# EasyEDA schematic doan20192.json
TITLE: Do an ver 1; REV: 1.0; Date: 2020-02-19; Sheet: 1/1; Drawn By: dienvx1997bn; Company: DCE HUST
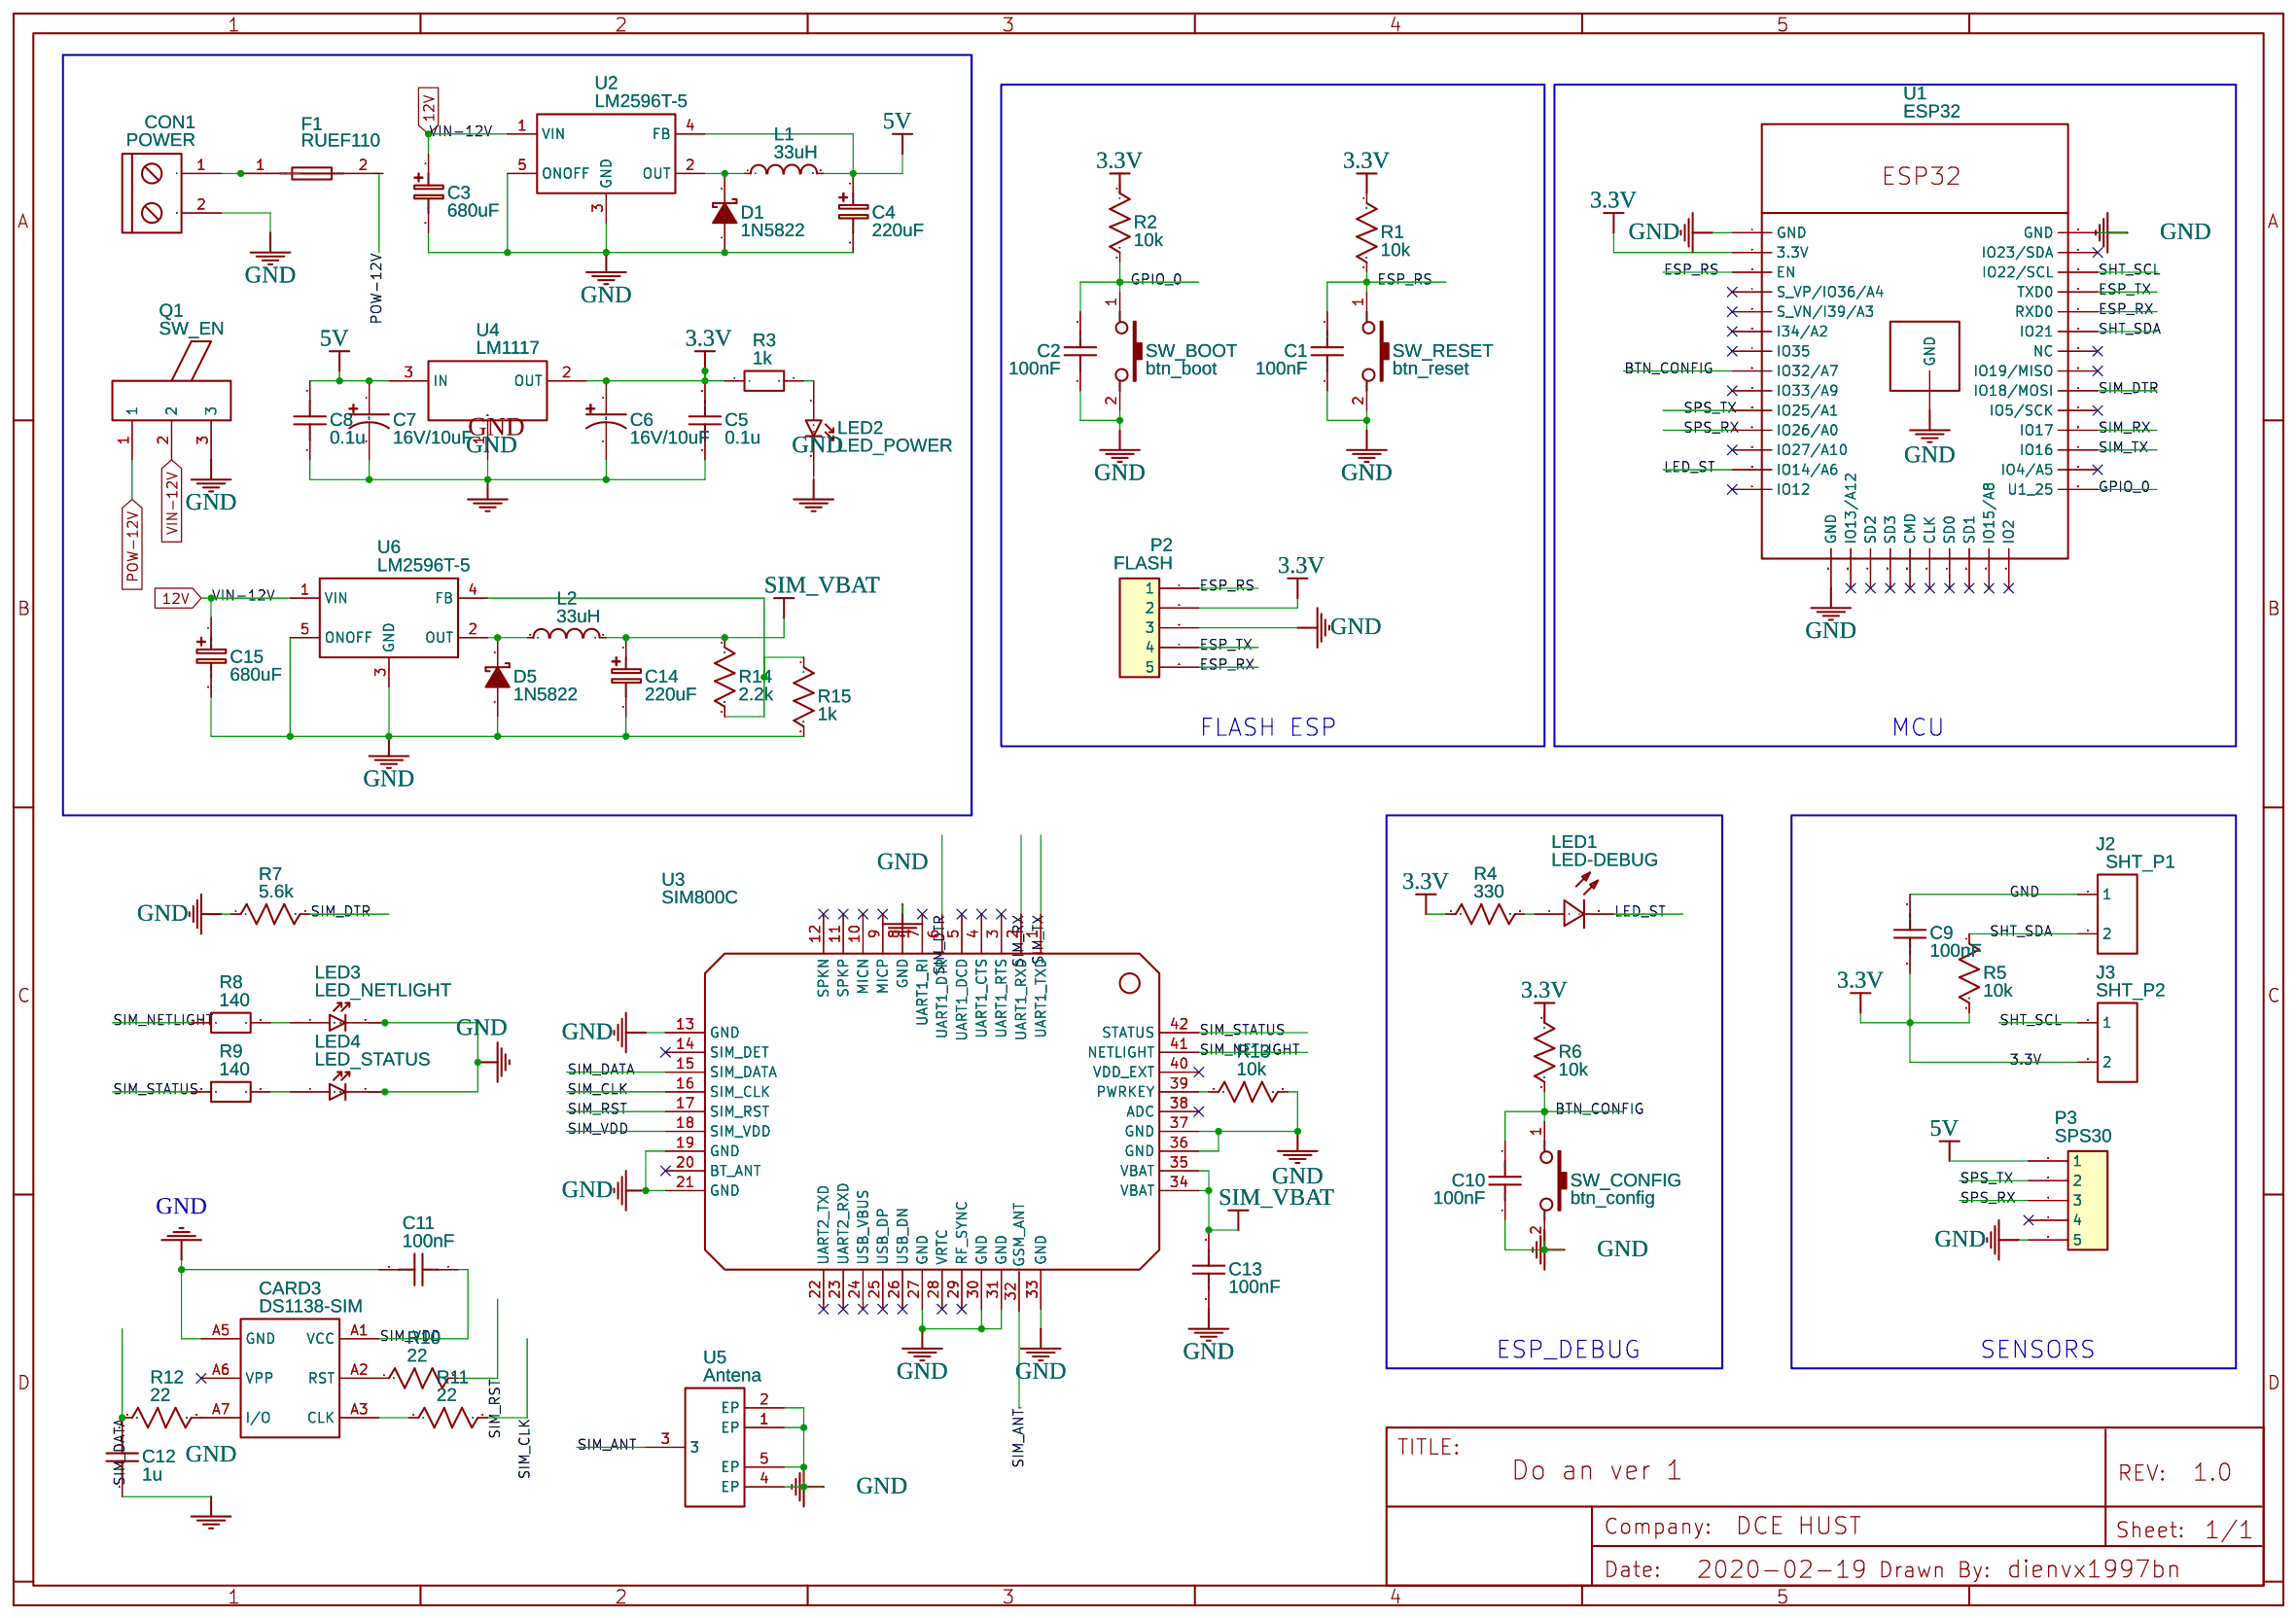
[diagram p0: schematic sheet]

## Parts
C1  100nF  [RAD-0.1]
C2  100nF  [RAD-0.1]
C3  680uF  [CAP-D3.0XF1.5]
C4  220uF  [CAP-D3.0XF1.5]
C5  0.1u  [RAD-0.1]
C6  16V/10uF  [CAP-D3.0XF1.5]
C7  16V/10uF  [CAP-D3.0XF1.5]
C8  0.1u  [RAD-0.1]
C9  100nF  [RAD-0.1]
C10  100nF  [RAD-0.1]
C11  100nF  [RAD-0.1]
C12  1u  [RAD-0.1]
C13  100nF  [RAD-0.1]
C14  220uF  [CAP-D3.0XF1.5]
C15  680uF  [CAP-D3.0XF1.5]
CARD3  DS1138-SIM  [DS1138-06-06SS4BSR]
CON1  POWER  [CONNECTOR_2PIN]
D1  1N5822  [DO-201AD]
D5  1N5822  [DO-201AD]
F1  RUEF110  [RUEF110]
J2  SHT_P1  [HDR-2X1/2.54]
J3  SHT_P2  [HDR-2X1/2.54]
L1  33uH  [AXIAL-0.4]
L2  33uH  [AXIAL-0.4]
LED1  LED-DEBUG  [LED-3MM/2.54]
LED2  LED_POWER  [LED-3MM-RED]
LED3  LED_NETLIGHT  [LED-3MM-RED]
LED4  LED_STATUS  [LED-3MM-RED]
P2  FLASH  [HDR-5X1/2.54]
P3  SPS30  [HDR-5X1/2.54]
Q1  SW_EN  [MTS-103-A2]
R1  10k  [AXIAL-0.3]
R2  10k  [AXIAL-0.3]
R3  1k  [AXIAL-0.3]
R4  330  [AXIAL-0.3]
R5  10k  [AXIAL-0.3]
R6  10k  [AXIAL-0.3]
R7  5.6k  [AXIAL-0.3]
R8  140  [AXIAL-0.3]
R9  140  [AXIAL-0.3]
R10  22  [AXIAL-0.3]
R11  22  [AXIAL-0.3]
R12  22  [AXIAL-0.3]
R13  10k  [AXIAL-0.3]
R14  2.2k  [AXIAL-0.3]
R15  1k  [AXIAL-0.3]
SW_BOOT  btn_boot  [SW-TH_4PIN-L6.00-W6.00]
SW_CONFIG  btn_config  [SW-TH_4PIN-L6.00-W6.00]
SW_RESET  btn_reset  [SW-TH_4PIN-L6.00-W6.00]
U1  ESP32  [ESP32_PCB]
U2  LM2596T-5  [TO-220-5(FORMING)]
U3  SIM800C  [SIM800C]
U4  LM1117  [T03B]
U5  Antena  [SOCKET]
U6  LM2596T-5  [TO-220-5(FORMING)]

## Library data of the parts
C1 C2 C5 C8-C13 = Cap_RAD-0.1_US
C3 C4 C14 C15 = Cap_Electrolytic(TH)_D3.0XF1.5_EU: Contributor: EasyEDA
C6 C7 = Cap_Electrolytic(TH)_D3.0XF1.5_US
CARD3 = -: Supplier: LCSC; Manufacturer: CONNFLY; Supplier Part: C96105
CON1 = Connector_2pin: Contributor: Dutzu
D1 D5 = 1N5822: Supplier Part: C82806; Supplier: LCSC; Manufacturer: LRC
F1 = RUEF110: Supplier Part: C5395; Supplier: LCSC
J2 J3 = J-Header-Male-2.54_1x2: Supplier Part: C86471; Supplier: LCSC; Manufacturer: TE Connectivity; Manufacturer Part: 826629-2; image: //image.lceda.cn/szlcsc/C86471.jpg; link: //image.lceda.cn/szlcsc/C86471.jpg
L1 L2 = Inductor_AXIAL-0.4_US
LED1 = LED-3MM: Supplier: LCSC; Manufacturer: EVERLIGHT; Manufacturer Part: 204-10SURD/S530-A3; Supplier Part: C99772
LED2-LED4 = LED-3MM-RED: Contributor: hctan22
P2 P3 = Header-Female-2.54_1x5: Supplier Part: C46341; Supplier: LCSC; Manufacturer: ReliaPro; Manufacturer Part: Female header　2.54 1*5Ｐ
Q1 = MTS-103-A2: Contributor: Николай Веренич
R1 R2 R4-R7 R10-R15 = Res_AXIAL-0.3(1/8W)_US
R3 R8 R9 = Res_AXIAL-0.3(1/8W)_EU
SW_BOOT SW_CONFIG SW_RESET = Button-6x6x6mm: Supplier Part: C71836; Supplier: LCSC; Manufacturer: BBJ; Manufacturer Part: Switch,6*6*6Plastic head,260G, 0.25mm,Straight line; Contributor: vanjo22
U1 = ESP32: Manufacturer Part: New SchematicLib; Contributor: paulohenriquerosa1810
U2 U6 = LM2596T-5: Contributor: KiCad; Supplier Part: undefined; Supplier: LCSC; Manufacturer: TI
U3 = SIM800C: Supplier Part: C69119; Supplier: LCSC; Manufacturer: SIMCOM; Manufacturer Part: SIM800C 24Mbit; image: //image.lceda.cn/szlcsc/C69119.jpg; Contributor: Mikhail07
U4 = LM1117T-5.0NOPB: 800mA Low-Dropout Linear Regulator, 3-pin TO-220, Pb-Free
U5 = -: Supplier: LCSC; Supplier Part: C127838; Manufacturer: TE Connectivity; Manufacturer Part: 5-1814832-1; Contributor: LCSC

## Nets
3.3V: C5.2 C6.1 C9.1 J3.2 P2.2 R1.1 R2.1 R3.1 R4.1 R5.2 R6.1 U1.2(3.3V) U4.2(OUT)
5V: C4.1 C7.1 C8.2 L1.2 P3.1 U2.4(FB) U4.3(IN)
12V: C3.1 C15.1 Q1.2 U2.1(VIN) U6.1(VIN)
GND: C1.1 C2.1 C3.2 C4.2 C5.1 C6.2 C7.2 C8.1 C9.2 C10.1 C11.2 C12.1 C13.1 C14.2 C15.2 CARD3.A5(GND) CON1.2 D1.1(A) D5.1(A) J2.1 LED2.2 LED3.2 LED4.2 P2.3 P3.5 Q1.3 R7.1 R13.2 R15.2 SW_BOOT.2 SW_CONFIG.2 SW_RESET.2 U1.1(GND) U1.15(GND) U1.38(GND) U1.39(GND) U2.3(GND) U2.5(ONOFF) U3.8(GND) U3.13(GND) U3.19(GND) U3.21(GND) U3.27(GND) U3.30(GND) U3.31(GND) U3.33(GND) U3.36(GND) U3.37(GND) U4.1(GND) U5.1(EP) U5.2(EP) U5.4(EP) U5.5(EP) U6.3(GND) U6.5(ONOFF)
BTN_CONFIG: C10.2 R6.2 SW_CONFIG.1 U1.8(IO32/A7)
ESP_RS: C1.2 P2.1 R1.2 SW_RESET.1 U1.3(EN)
ESP_RX: P2.5 U1.34(RXD0)
ESP_TX: P2.4 U1.35(TXD0)
GPIO_0: C2.2 R2.2 SW_BOOT.1 U1.25(U1)
LED_ST: LED1.2(-) U1.13(IO14/A6)
POW-12V: Q1.1
SHT_SCL: J3.1 U1.36(IO22/SCL)
SHT_SDA: J2.2 R5.1 U1.33(IO21)
SIM_ANT: U3.32(GSM_ANT) U5.3
SIM_CLK: R11.2 U3.16(SIM_CLK)
SIM_DATA: C12.2 R12.1 U3.15(SIM_DATA)
SIM_DTR: R7.2 U1.30(IO18/MOSI) U3.6(UART1_DTR)
SIM_NETLIGHT: R8.1 U3.41(NETLIGHT)
SIM_RST: R10.2 U3.17(SIM_RST)
SIM_RX: U1.28(IO17) U3.2(UART1_RXD)
SIM_STATUS: R9.1 U3.42(STATUS)
SIM_TX: U1.27(IO16) U3.1(UART1_TXD)
SIM_VBAT: C13.2 C14.1 L2.2 R14.1 U3.34(VBAT) U3.35(VBAT)
SIM_VDD: C11.1 CARD3.A1(VCC) U3.18(SIM_VDD)
SPS_RX: P3.3 U1.11(IO26/A0)
SPS_TX: P3.2 U1.10(IO25/A1)
Net-(CARD3-A2): CARD3.A2(RST) R10.1
Net-(CARD3-A3): CARD3.A3(CLK) R11.1
Net-(CARD3-A7): CARD3.A7(I/O) R12.2
Net-(CON1-1): CON1.1 F1.1
Net-(D1-2): D1.2(K) L1.1 U2.2(OUT)
Net-(D5-2): D5.2(K) L2.1 U6.2(OUT)
Net-(LED1-1): LED1.1(+) R4.2
Net-(LED2-1): LED2.1 R3.2
Net-(LED3-1): LED3.1 R8.2
Net-(LED4-1): LED4.1 R9.2
Net-(R13-1): R13.1 U3.39(PWRKEY)
Net-(R14-2): R14.2 R15.1 U6.4(FB)

Not connected (* = marked no-connect by the designer): CARD3 A6(VPP)*; F1 2; P3 4*; U1 4(S_VP/IO36/A4)* 5(S_VN/I39/A3)* 6(I34/A2)* 7(IO35)* 9(IO33/A9)* 12(IO27/A10)* 14(IO12)* 16(IO13/A12)* 17(SD2)* 18(SD3)* 19(CMD)* 20(CLK)* 21(SD0)* 22(SD1)* 23(IO15/A8)* 24(IO2)* 26(IO4/A5)* 29(IO5/SCK)* 31(IO19/MISO)* 32(NC)* 37(IO23/SDA)*; U3 3(UART1_RTS)* 4(UART1_CTS)* 5(UART1_DCD)* 7(UART1_RI)* 9(MICP)* 10(MICN)* 11(SPKP)* 12(SPKN)* 14(SIM_DET)* 20(BT_ANT)* 22(UART2_TXD)* 23(UART2_RXD)* 24(USB_VBUS)* 25(USB_DP)* 26(USB_DN)* 28(VRTC)* 29(RF_SYNC)* 38(ADC)* 40(VDD_EXT)*

## Notes on the sheet
- FLASH ESP
- MCU
- ESP_DEBUG
- SENSORS
